# Altium project LFI Power Board.PrjPcb
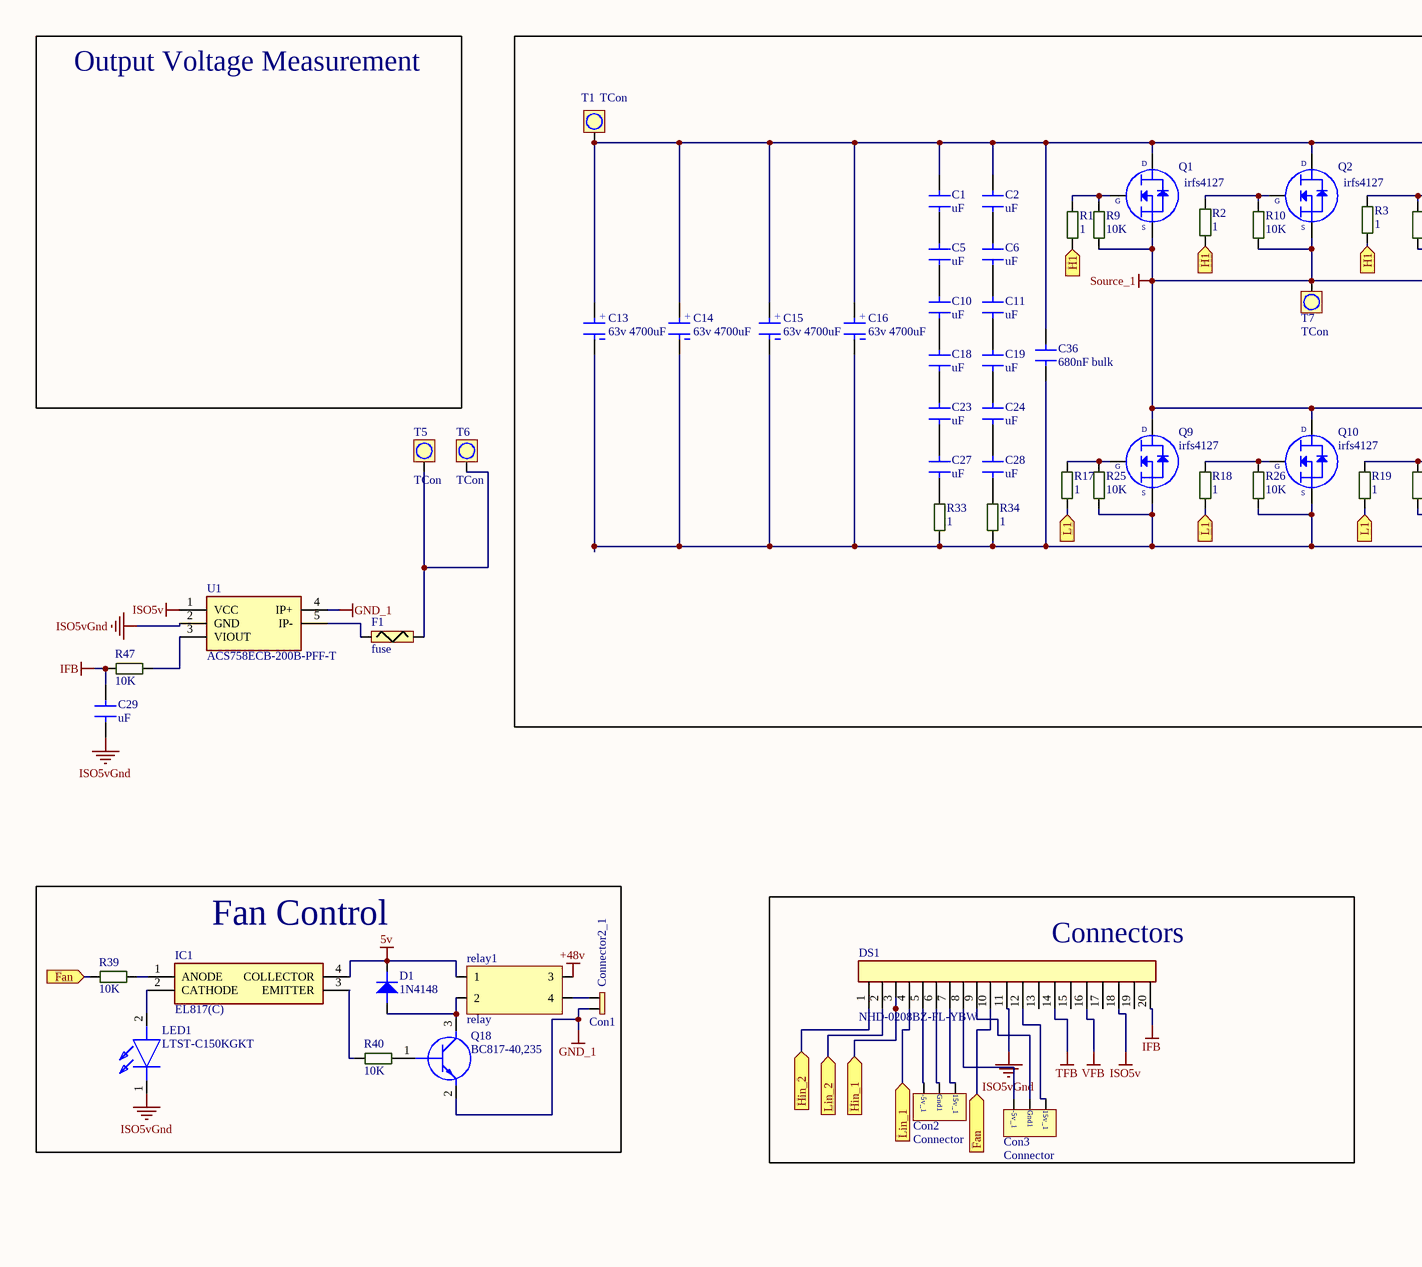
[diagram p0: LFI Power Board Sheet1.SchDoc, left]
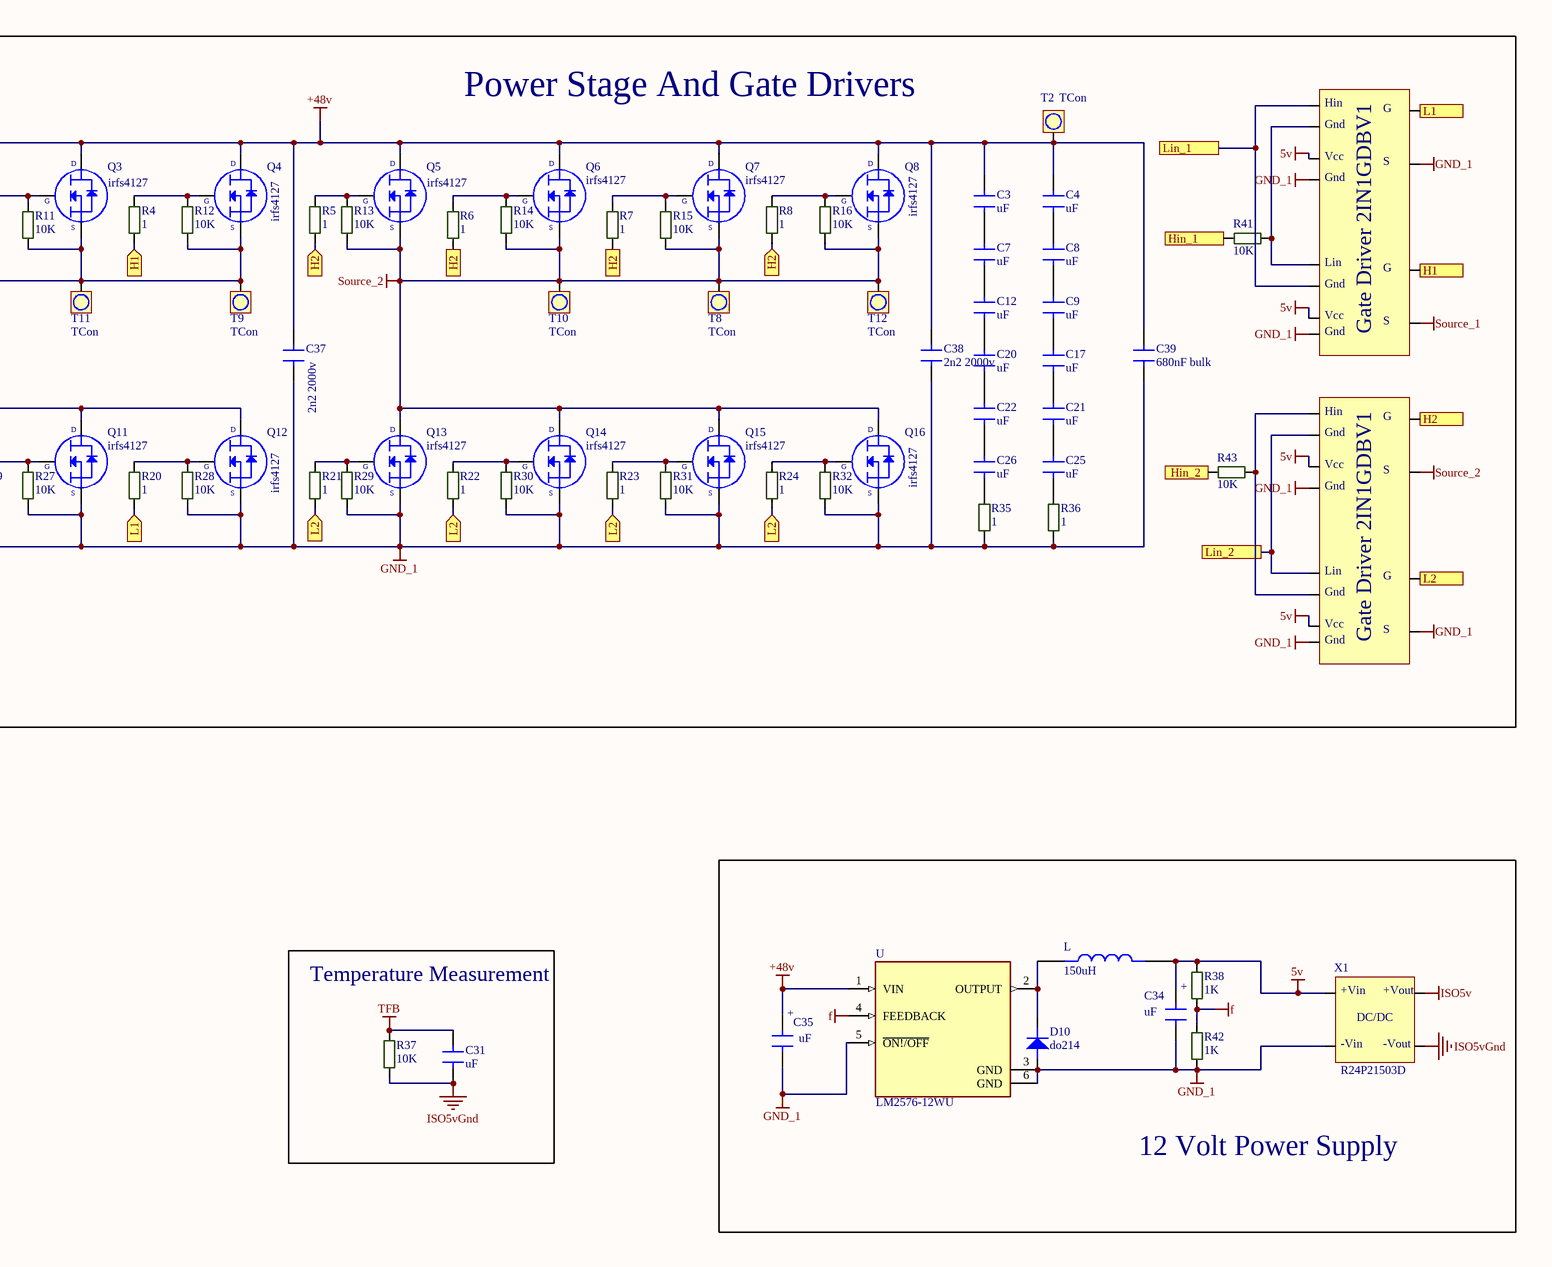
[diagram p1: LFI Power Board Sheet1.SchDoc, right]
1 sheet, 123 parts. Net scope: flat (ports and power ports of the same name join across sheets).
Board file: LFI Power Board PCB1.PcbDoc

## Sheet LFI Power Board Sheet1.SchDoc
size A2

### Parts
C1  uF  [C-1206]
C2  uF  [C-1206]
C3  uF  [C-1206]
C4  uF  [C-1206]
C5  uF  [C-1206]
C6  uF  [C-1206]
C7  uF  [C-1206]
C8  uF  [C-1206]
C9  uF  [C-1206]
C10  uF  [C-1206]
C11  uF  [C-1206]
C12  uF  [C-1206]
C13  63v 4700uF  [Koshin 63v 4700 cap]
C14  63v 4700uF  [Koshin 63v 4700 cap]
C15  63v 4700uF  [Koshin 63v 4700 cap]
C16  63v 4700uF  [Koshin 63v 4700 cap]
C17  uF  [C-1206]
C18  uF  [C-1206]
C19  uF  [C-1206]
C20  uF  [C-1206]
C21  uF  [C-1206]
C22  uF  [C-1206]
C23  uF  [C-1206]
C24  uF  [C-1206]
C25  uF  [C-1206]
C26  uF  [C-1206]
C27  uF  [C-1206]
C28  uF  [C-1206]
C29  uF  [C-1206]
C31  uF  [C-1206]
C34  uF  [CapSmdElc]
C35  uF  [CapSmdElc]
C36  680nF bulk  [680nF bulk]
C37  2n2 2000v  [2n2 2000v]
C38  2n2 2000v  [2n2 2000v]
C39  680nF bulk  [680nF bulk]
Con1  Connector2_1  [2pinCon]
Con2  Connector  [Output Connector]
Con3  Connector  [Output Connector]
D1  1N4148  [SOD123]
D10  do214  [DO-214AC]
DS1  NHD-0208BZ-FL-YBW  [idc20]
F1  fuse  [Fuse]
G1  GateDriver Board  [Gate Driver]  (value not drawn)
G2  GateDriver Board  [Gate Driver]  (value not drawn)
IC1  EL817(C)  [DIP762W60P254L458H480Q4N]
L  150uH  [IND_B1047AS-151M=P3]
LED1  LTST-C150KGKT  [L-1206]
Q1  irfs4127  [DPAK_TO263]
Q2  irfs4127  [DPAK_TO263]
Q3  irfs4127  [DPAK_TO263]
Q4  irfs4127  [DPAK_TO263]
Q5  irfs4127  [DPAK_TO263]
Q6  irfs4127  [DPAK_TO263]
Q7  irfs4127  [DPAK_TO263]
Q8  irfs4127  [DPAK_TO263]
Q9  irfs4127  [DPAK_TO263]
Q10  irfs4127  [DPAK_TO263]
Q11  irfs4127  [DPAK_TO263]
Q12  irfs4127  [DPAK_TO263]
Q13  irfs4127  [DPAK_TO263]
Q14  irfs4127  [DPAK_TO263]
Q15  irfs4127  [DPAK_TO263]
Q16  irfs4127  [DPAK_TO263]
Q18  BC817-40,235  [SOT95P230X110-3N]
R1  1  [R-2512W]
R2  1  [R-2512W]
R3  1  [R-2512W]
R4  1  [R-2512W]
R5  1  [R-2512W]
R6  1  [R-2512W]
R7  1  [R-2512W]
R8  1  [R-2512W]
R9  10K  [R-1206]
R10  10K  [R-1206]
R11  10K  [R-1206]
R12  10K  [R-1206]
R13  10K  [R-1206]
R14  10K  [R-1206]
R15  10K  [R-1206]
R16  10K  [R-1206]
R17  1  [R-2512W]
R18  1  [R-2512W]
R19  1  [R-2512W]
R20  1  [R-2512W]
R21  1  [R-2512W]
R22  1  [R-2512W]
R23  1  [R-2512W]
R24  1  [R-2512W]
R25  10K  [R-1206]
R26  10K  [R-1206]
R27  10K  [R-1206]
R28  10K  [R-1206]
R29  10K  [R-1206]
R30  10K  [R-1206]
R31  10K  [R-1206]
R32  10K  [R-1206]
R33  1  [R-2512W]
R34  1  [R-2512W]
R35  1  [R-2512W]
R36  1  [R-2512W]
R37  10K  [R-1206]
R38  1K  [R-1206]
R39  10K  [R-1206]
R40  10K  [R-1206]
R41  10K  [R-1206]
R42  1K  [R-1206]
R43  10K  [R-1206]
R47  10K  [R-1206]
relay1  relay  [Relay]
T1  TCon  [tCon]
T2  TCon  [tCon]
T5  TCon  [tCon]
T6  TCon  [tCon]
T7  TCon  [tCon]
T8  TCon  [tCon]
T9  TCon  [tCon]
T10  TCon  [tCon]
T11  TCon  [tCon]
T12  TCon  [tCon]
U  LM2576-12WU  [TO17P1435X465-6N]
U1  ACS758ECB-200B-PFF-T  [ACS756SCA-050B-PFF-T_2]
X1  R24P21503D  [SIP7]

### Blocks framed on the sheet
Power Stage And Gate Drivers: C1-C28 C36-C39 G1 G2 Q1-Q16 R1-R36 R41 R43 T1 T2 T7-T12
Fan Control: Con1 D1 IC1 LED1 Q18 R39 R40 relay1
12 Volt Power Supply: C34 C35 D10 L R38 R42 U X1
Connectors: Con2 Con3 DS1
Temperature Measurement: C31 R37

### Ports
Fan (in), H1 (in), H1 (out), H2 (in), H2 (out), Hin_1, Hin_1 (in), Hin_2, Hin_2 (in), L1 (in), L1 (out), L2 (in), L2 (out), Lin_1, Lin_1 (in), Lin_2, Lin_2 (in)

### Nets
5v: C34.1 D1.k G1.3 G1.7 G2.3 G2.7 IC1.4(COLLECTOR) L.2 R38.2 relay1.1 X1.1
+48v: C1.2 C2.2 C3.2 C4.2 C13.2 C14.2 C15.2 C16.2 C35.1 C36.2 C37.2 C38.2 C39.2 Q1.3 Q2.3 Q3.3 Q4.3 Q5.3 Q6.3 Q7.3 Q8.3 relay1.3 T1.1 T2.1 U.1(VIN)
f: R38.1 R42.2 U.4(FEEDBACK)
GND_1: C13.1 C14.1 C15.1 C16.1 C34.2 C35.2 C36.1 C37.1 C38.1 C39.1 Con1.2 D10.a G1.4 G1.8 G1.10 G2.4 G2.8 G2.12 Q9.2 Q10.2 Q11.2 Q12.2 Q13.2 Q14.2 Q15.2 Q16.2 Q18.2(E) R25.1 R26.1 R27.1 R28.1 R29.1 R30.1 R31.1 R32.1 R33.1 R34.1 R35.1 R36.1 R42.1 U.3(GND) U.5(~{ON!/OFF}) U.6(GND) U1.4(IP+) X1.2
IFB: C29.2 DS1.20 R47.2
ISO5v: DS1.18 U1.1(VCC) X1.7
ISO5vGnd: C29.1 C31.1 DS1.11(DB4) LED1.1(K) R37.1 U1.2(GND) X1.5
Source_1: G1.12 Q1.2 Q2.2 Q3.2 Q4.2 Q9.3 Q10.3 Q11.3 Q12.3 R9.1 R10.1 R11.1 R12.1 T7.1 T9.1 T11.1
Source_2: G2.10 Q5.2 Q6.2 Q7.2 Q8.2 Q13.3 Q14.3 Q15.3 Q16.3 R13.1 R14.1 R15.1 R16.1 T8.1 T10.1 T12.1
TFB: C31.2 DS1.14(DB7) R37.2
VFB: DS1.16
NetC1_1: C1.1 C5.2
NetC2_1: C2.1 C6.2
NetC3_1: C3.1 C7.2
NetC4_1: C4.1 C8.2
NetC5_1: C5.1 C10.2
NetC6_1: C6.1 C11.2
NetC7_1: C7.1 C12.2
NetC8_1: C8.1 C9.2
NetC9_1: C9.1 C17.2
NetC10_1: C10.1 C18.2
NetC11_1: C11.1 C19.2
NetC12_1: C12.1 C20.2
NetC17_1: C17.1 C21.2
NetC18_1: C18.1 C23.2
NetC19_1: C19.1 C24.2
NetC20_1: C20.1 C22.2
NetC21_1: C21.1 C25.2
NetC22_1: C22.1 C26.2
NetC23_1: C23.1 C27.2
NetC24_1: C24.1 C28.2
NetC25_1: C25.1 R36.2
NetC26_1: C26.1 R35.2
NetC27_1: C27.1 R33.2
NetC28_1: C28.1 R34.2
NetCon1_1: Con1.1 relay1.4
NetCon2_1: Con2.1 DS1.7(DB0)
NetCon2_2: Con2.2 DS1.6(E)
NetCon2_3: Con2.3 DS1.5(R/W)
NetCon3_1: Con3.1 DS1.12(DB5)
NetCon3_2: Con3.2 DS1.9(DB2)
NetCon3_3: Con3.3 DS1.8(DB1)
NetD1_a: D1.a Q18.3(C) relay1.2
NetD10_k: D10.k L.1 U.2(OUTPUT)
NetDS1_1: DS1.1(VSS) R43.2 ; port Hin_2
NetDS1_2: DS1.2(VDD) G2.2 G2.5 ; port Lin_2
NetDS1_3: DS1.3(V0) R41.2 ; port Hin_1
NetDS1_4: DS1.4(RS) G1.1 G1.6 ; port Lin_1
NetDS1_10: DS1.10(DB3) R39.2 ; port Fan
NetF1_1: F1.1 U1.5(IP-)
NetF1_2: F1.2 T5.1 T6.1
NetG1_2: G1.2 G1.5 R41.1
NetG1_9: G1.9 R17.1 R18.1 R19.1 R20.1 ; port L1
NetG1_11: G1.11 R1.1 R2.1 R3.1 R4.1 ; port H1
NetG2_1: G2.1 G2.6 R43.1
NetG2_9: G2.9 R5.1 R6.1 R7.1 R8.1 ; port H2
NetG2_11: G2.11 R21.1 R22.1 R23.1 R24.1 ; port L2
NetIC1_1: IC1.1(ANODE) R39.1
NetIC1_2: IC1.2(CATHODE) LED1.2(A)
NetIC1_3: IC1.3(EMITTER) R40.2
NetQ1_1: Q1.1 R1.2 R9.2
NetQ2_1: Q2.1 R2.2 R10.2
NetQ3_1: Q3.1 R3.2 R11.2
NetQ4_1: Q4.1 R4.2 R12.2
NetQ5_1: Q5.1 R5.2 R13.2
NetQ6_1: Q6.1 R6.2 R14.2
NetQ7_1: Q7.1 R7.2 R15.2
NetQ8_1: Q8.1 R8.2 R16.2
NetQ9_1: Q9.1 R17.2 R25.2
NetQ10_1: Q10.1 R18.2 R26.2
NetQ11_1: Q11.1 R19.2 R27.2
NetQ12_1: Q12.1 R20.2 R28.2
NetQ13_1: Q13.1 R21.2 R29.2
NetQ14_1: Q14.1 R22.2 R30.2
NetQ15_1: Q15.1 R23.2 R31.2
NetQ16_1: Q16.1 R24.2 R32.2
NetQ18_1: Q18.1(B) R40.1
NetR47_1: R47.1 U1.3(VIOUT)

Not connected (* = marked no-connect by the designer): DS1 13(DB6) 15 17 19

### Notes on the sheet
- Output Voltage Measurement
- Title
- Size:
- Date:
- A4
- Number:
- Time:
- Revision:
- Sheet
- of
- File:
- (in symbol Aluminum Electrolytic Capacitors) +
- (in symbol C-10uf) +
- (in symbol Connector) -5v_1; Gnd1; 15v_1
- (in symbol GateDriver Board) Hin; G; Gnd; Vcc; S; Lin; Gate Driver 2IN1GDBV1
- (in symbol IRFS4127TRLPBF) D; G; S
- (in symbol R24P21503D) +Vin; +Vout; DC/DC; -Vin; -Vout

### Library data of the parts
C1-C12 C17-C29 C31 = C-1206
C13-C16 = Aluminum Electrolytic Capacitors: PKL5-063V472MM450 Aluminum Electrolytic Capacitors - Snap In 63volts 4700uF 20%; Manufacturer: Nichicon; Manufacturer Part Number: LKS1J472MESZ; Capacitance: 4.7mF; Ripple Current: 3A; Life (Hours): 1000Hour; ComponentLink2Description: https://www.ozdisan.com/pasif-komponentler/kondansatorler/aluminyum-kondansatorler/PKL5-063V472MM450; ComponentLink2URL: https://www.ozdisan.com/pasif-komponentler/kondansatorler/aluminyum-kondansatorler/PKL5-063V472MM450; Supplier 1: Mouser; RoHS: Yes; Mount: Through Hole; Case/Package: Radial; Min Operating Temperature: -40°C; Max Operating Temperature: 85°C; Package Quantity: 250; Voltage Rating: 63V; Tolerance: 20%; Packaging: Bulk; Voltage Rating (DC): 63V; Termination: Snap in; Diameter: 22mm; Length: 45mm; Lead Pitch: 0.394inch; Height - Seated (Max): 1.772inch; Supplier Part Number 1: 647-LKS1J472MESZ
C34 C35 = C-10uf
D1 = 1N4148: DIODE FAST SWITCHING Single 150mA 75V SMT SOD323
D10 = do214: DIODE FAST SWITCHING Single 150mA 75V SMT SOD323
DS1 = NHD-0208BZ-FL-YBW: Display; Manufacturer_Name: Newhaven Display; Allied_Number: 70518052; Datasheet Link: https://www.newhavendisplay.com/specs/NHD-0208BZ-FL-YBW.pdf; Height: 13.5mm; Manufacturer_Part_Number: NHD-0208BZ-FL-YBW; Mouser Part Number: 763-0208BZ-FL-YBW; Mouser Price/Stock: https://www.mouser.com/Search/Refine.aspx?Keyword=763-0208BZ-FL-YBW; Allied Price/Stock: https://www.alliedelec.com/newhavendisplayinternational-nhd-0208bz-fl-ybw/70518052/
IC1 = EL817(C): Integrated Circuit; Manufacturer_Name: Everlight; Datasheet Link: https://componentsearchengine.com/Datasheets/1/EL817(C).pdf; Height: 4.8mm; Manufacturer_Part_Number: EL817(C); Mouser Part Number: 638-EL817C; Mouser Price/Stock: https://www.mouser.com/Search/Refine.aspx?Keyword=638-EL817C
L = 150uH: Inductor with Inductance: 150uH Tol. +/-20%, Package: 2929 _7373_; MF: Murata; MP: B1047AS-151M=P3; Value: *; SnapEDA_Link: https://www.snapeda.com/parts/B1047AS-151M%3DP3/Murata/view-part/4548598/?ref=snap; Availability: Unavailable; Package: NONSTANDARD; Price: None
LED1 = LTST-C150KGKT: LED; Manufacturer_Name: Lite-On; Datasheet Link: http://optoelectronics.liteon.com/upload/download/ds22-2000-072/ltst-c150kgkt.pdf; Height: 1.2mm; Manufacturer_Part_Number: LTST-C150KGKT; Mouser Part Number: 859-LTST-C150KGKT; Mouser Price/Stock: https://www.mouser.com/Search/Refine.aspx?Keyword=859-LTST-C150KGKT; RS Part Number: 6920871; RS Price/Stock: https://uk.rs-online.com/web/p/products/6920871
Q1-Q16 = IRFS4127TRLPBF: MOSFET N-CH 200V 72A D2PAK; Manufacturer: International Rectifier; Rds On Max: 22mR; Input Capacitance: 5.38nF; Rise Time: 18ns; Max Power Dissipation: 375W; Fall Time: 22ns; Turn-Off Delay Time: 56ns; Turn-On Delay Time: 17ns; Element Configuration: Single; Gate to Source Voltage (Vgs): 20V; Supplier 1: Digi-Key; Manufacturer Part Number: IRFS4127TRLPBF; RoHS: Yes; Stock 1: 15054; Pricing 1: 1 = 3,97000, 10 = 3,54100, 100 = 2,90330 (USD); Mount: Surface Mount; Case/Package: D2PAK; Number of Pins: 3; Min Operating Temperature: -55°C; Max Operating Temperature: 175°C; Package Quantity: 1; Packaging: Tape and Reel; Drain to Source Voltage (Vdss): 200V; Continuous Drain Current (ID): 72A; Drain to Source Breakdown Voltage: 200V; Drain to Source Resistance: 22mR; Power Dissipation: 375W; On-State Resistance: 22MR; ComponentLink1URL: https://datasheet.ciiva.com/939/irfs4127pbf-939456.pdf?src-supplier=Digi-Key; ComponentLink1Description: https://datasheet.ciiva.com/939/irfs4127pbf-939456.pdf?src-supplier=Digi-Key; ComponentLink2URL: https://datasheet.ciiva.com/939/irfs4127pbf-939457.pdf?src-supplier=Digi-Key; ComponentLink2Description: https://datasheet.ciiva.com/939/irfs4127pbf-939457.pdf?src-supplier=Digi-Key; ComponentLink3URL: https://datasheet.ciiva.com/939/irfs4127pbf-939458.pdf?src-supplier=Digi-Key; ComponentLink3Description: https://datasheet.ciiva.com/939/irfs4127pbf-939458.pdf?src-supplier=Digi-Key; ComponentLink4URL: https://datasheet.ciiva.com/16221/irfs4127pbf-16221031.pdf?src-supplier=Future+Electronics; ComponentLink4Description: https://datasheet.ciiva.com/16221/irfs4127pbf-16221031.pdf?src-supplier=Future+Electronics; Supplier Part Number 1: IRFS4127TRLPBFCT-ND
Q18 = BC817-40,235: Transistor BJT NPN; Manufacturer_Name: Nexperia; Datasheet Link: http://assets.nexperia.com/documents/data-sheet/BC817_BC817W_BC337.pdf; Height: 1.1mm; Manufacturer_Part_Number: BC817-40,235; Mouser Part Number: 771-BC817-40235; Mouser Price/Stock: https://www.mouser.com/Search/Refine.aspx?Keyword=771-BC817-40235; RS Part Number: 1707957; RS Price/Stock: http://uk.rs-online.com/web/p/products/1707957
R1-R8 R17-R24 R33-R36 = 0207 melf: ComponentLink1Description: https://www.ozdisan.com/pasif-komponentler/direncler/smt-smd-direncler/M271UFG100KT20; ComponentLink1URL: https://www.ozdisan.com/pasif-komponentler/direncler/smt-smd-direncler/M271UFG100KT20
R9-R16 R25-R32 R37-R43 R47 = R-1206_GS: 1206S4F1002T5E; ComponentLink1Description: link; ComponentLink1URL: https://www.ozdisan.com/pasif-komponentler/direncler/smt-smd-direncler/1206S4F1002T5E
T1 T2 T5-T12 = Terminal Connector: ComponentLink1Description: https://www.ozdisan.com/konnektor-baglanti-elemanlari/terminal-konnektorler/vida-tipi-konnektorler/K36-00AH; ComponentLink1URL: https://www.ozdisan.com/konnektor-baglanti-elemanlari/terminal-konnektorler/vida-tipi-konnektorler/K36-00AH
U = LM2576-12WU: Buck Switching Regulator IC Positive Fixed 12V 1 Output 3A TO-263-6, DÂ²Pak _5 Leads + Tab_, TO-263BA; MF: Microchip; Package: TO-263-5 Microchip; MP: LM2576-12WU; Value: *; SnapEDA_Link: https://www.snapeda.com/parts/LM2576-12WU/Microchip/view-part/2873733/?ref=snap; Price: None; Availability: Unavailable
U1 = ACS758ECB-200B-PFF-T: Undefined or Miscellaneous; Manufacturer_Name: Allegro Microsystems; Datasheet Link: http://www.farnell.com/datasheets/926109.pdf; Manufacturer_Part_Number: ACS758ECB-200B-PFF-T; Arrow Part Number: ACS758ECB-200B-PFF-T; Arrow Price/Stock: https://www.arrow.com/en/products/acs758ecb-200b-pff-t/allegro-microsystems
X1 = R24P21503D: Manufacturer: Recom; Max Output Voltage: 15V; Supplier 1: Digi-Key; Manufacturer Part Number: R24P21503D; RoHS: No; Stock 1: 378; Pricing 1: 1 = 8.78000, 5 = 8.71200, 10 = 8.64500, 25 = 8.51200, 50 = 8.24600, 100 = 7.44800, 250 = 7.31500, 500 = 7.18200 (USD); Weight: 4.3g; Length: 19.5mm; Height: 12.5mm; Width: 9.8mm; Supplier Part Number 1: 945-3071-5-ND
Con1 = Connector2_1: System: Connector